# Altium schematic sheet Схема МК и датчиков Velvet Controller.SchDoc
size A2; SheetNumber: 2; SheetTotal: 6
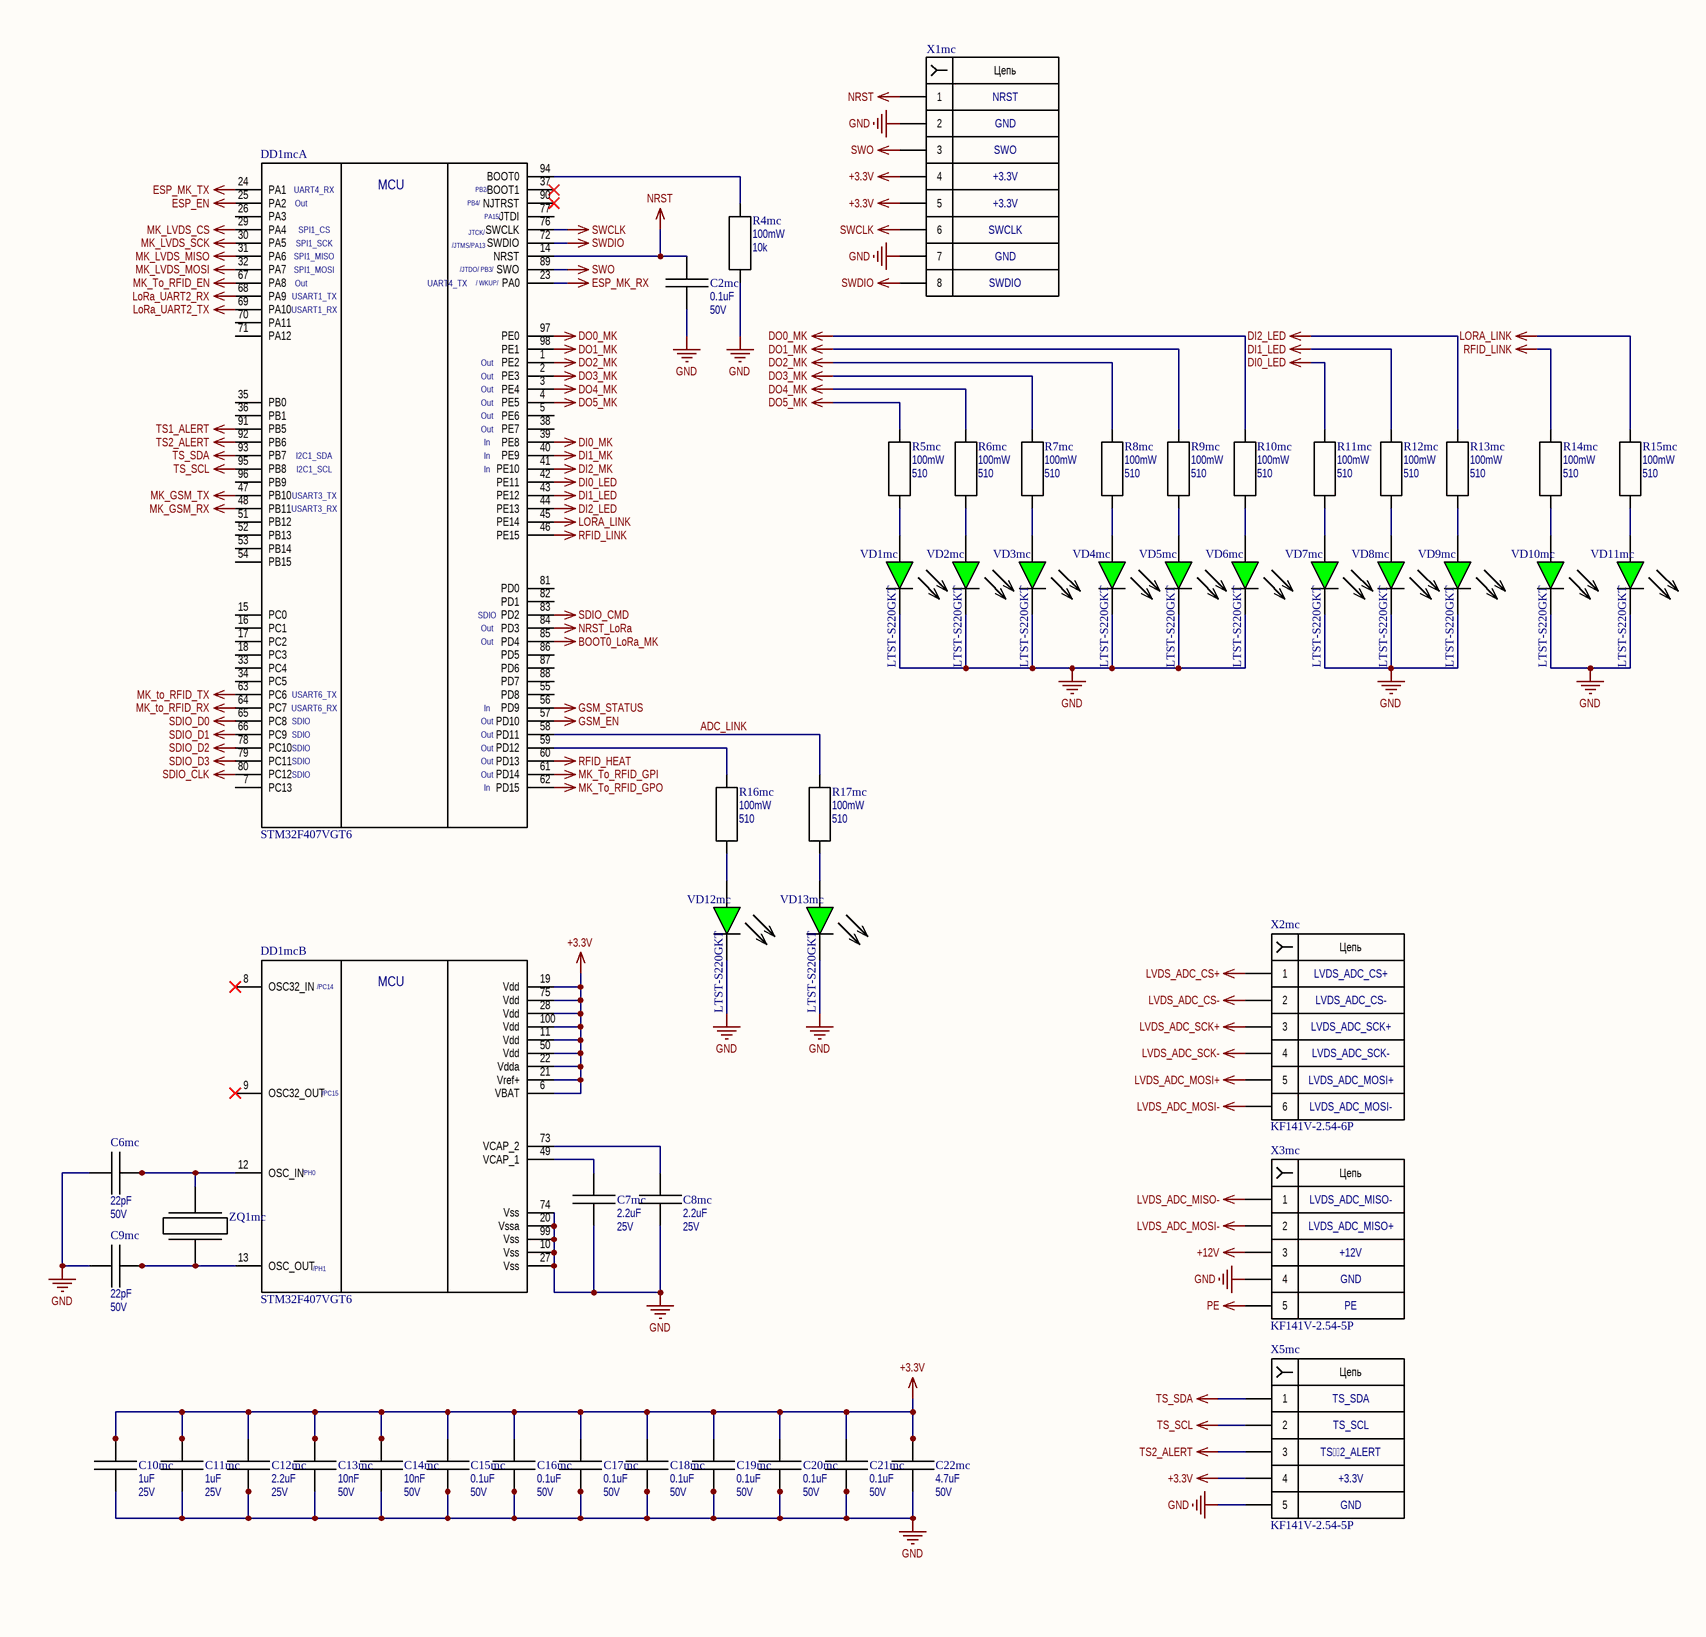
[diagram p0: Схема МК и датчиков Velvet Controller.SchDoc, left]
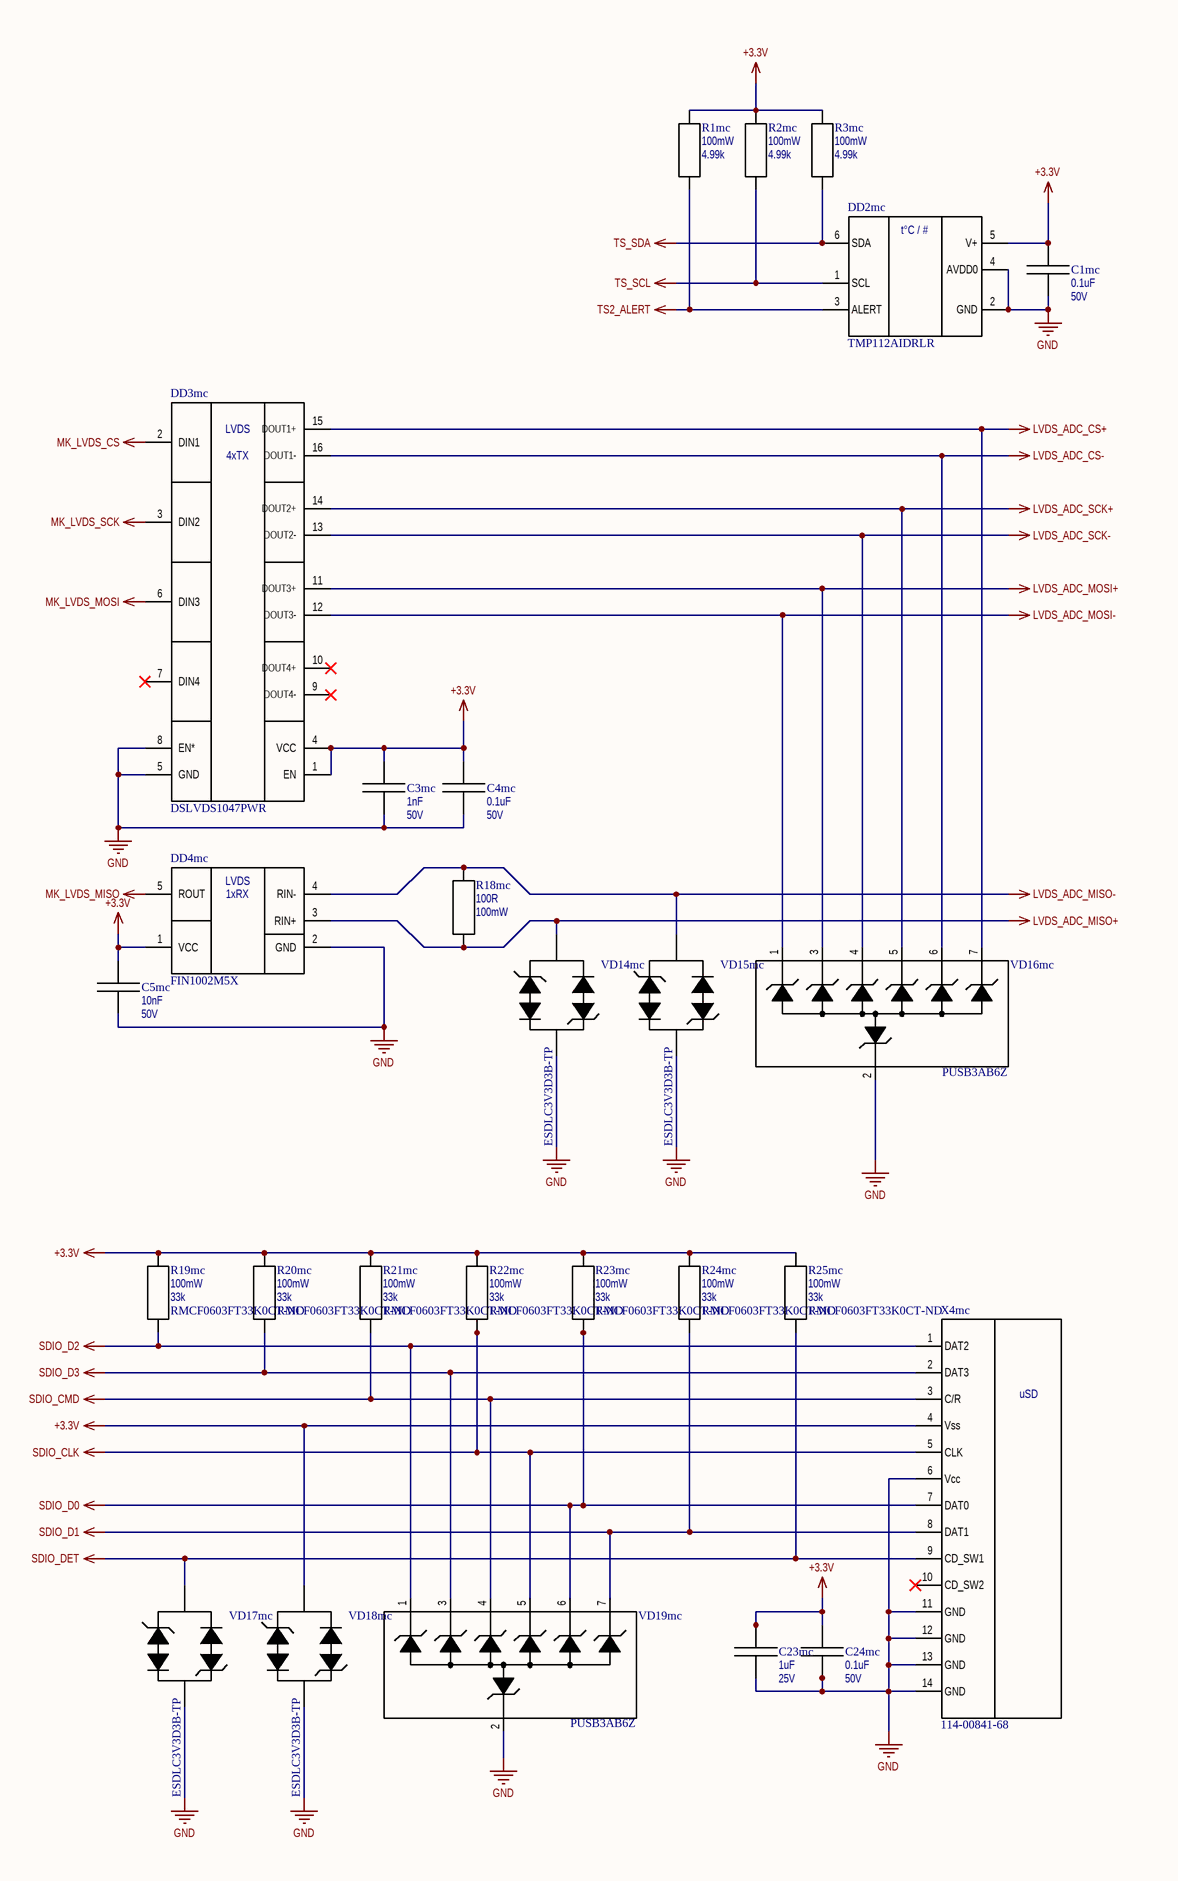
[diagram p1: Схема МК и датчиков Velvet Controller.SchDoc, right]

## Parts
C1mc  Capacitance: 0.1uF  Rated Voltage: 50V  [CAP 0603 IPC MAX]  (hidden comment: GCM188R71H104KA57D)
C2mc  Capacitance: 0.1uF  Rated Voltage: 50V  [CAP 0603 IPC MAX]  (hidden comment: GCM188R71H104KA57D)
C3mc  Capacitance: 1nF  Rated Voltage: 50V  [CAP 0603 IPC MAX]  (hidden comment: GCM188R71H102KA37D)
C4mc  Capacitance: 0.1uF  Rated Voltage: 50V  [CAP 0603 IPC MAX]  (hidden comment: GCM188R71H104KA57D)
C5mc  Capacitance: 10nF  Rated Voltage: 50V  [CAP 0603 IPC MAX]  (hidden comment: CL10B103KB8NNNC)
C6mc  Capacitance: 22pF  Rated Voltage: 50V  [CAP 0603 IPC MAX]  (hidden comment: CC0603JRNPO9BN220)
C7mc  Capacitance: 2.2uF  Rated Voltage: 25V  [CAP 0603 IPC MAX]  (hidden comment: GRM188R61E225KA12D)
C8mc  Capacitance: 2.2uF  Rated Voltage: 25V  [CAP 0603 IPC MAX]  (hidden comment: GRM188R61E225KA12D)
C9mc  Capacitance: 22pF  Rated Voltage: 50V  [CAP 0603 IPC MAX]  (hidden comment: CC0603JRNPO9BN220)
C10mc  Capacitance: 1uF  Rated Voltage: 25V  [CAP 0603 IPC MAX]  (hidden comment: TMK107BJ105KA-T)
C11mc  Capacitance: 1uF  Rated Voltage: 25V  [CAP 0603 IPC MAX]  (hidden comment: TMK107BJ105KA-T)
C12mc  Capacitance: 2.2uF  Rated Voltage: 25V  [CAP 0603 IPC MAX]  (hidden comment: GRM188R61E225KA12D)
C13mc  Capacitance: 10nF  Rated Voltage: 50V  [CAP 0603 IPC MAX]  (hidden comment: CL10B103KB8NNNC)
C14mc  Capacitance: 10nF  Rated Voltage: 50V  [CAP 0603 IPC MAX]  (hidden comment: CL10B103KB8NNNC)
C15mc  Capacitance: 0.1uF  Rated Voltage: 50V  [CAP 0603 IPC MAX]  (hidden comment: GCM188R71H104KA57D)
C16mc  Capacitance: 0.1uF  Rated Voltage: 50V  [CAP 0603 IPC MAX]  (hidden comment: GCM188R71H104KA57D)
C17mc  Capacitance: 0.1uF  Rated Voltage: 50V  [CAP 0603 IPC MAX]  (hidden comment: GCM188R71H104KA57D)
C18mc  Capacitance: 0.1uF  Rated Voltage: 50V  [CAP 0603 IPC MAX]  (hidden comment: GCM188R71H104KA57D)
C19mc  Capacitance: 0.1uF  Rated Voltage: 50V  [CAP 0603 IPC MAX]  (hidden comment: GCM188R71H104KA57D)
C20mc  Capacitance: 0.1uF  Rated Voltage: 50V  [CAP 0603 IPC MAX]  (hidden comment: GCM188R71H104KA57D)
C21mc  Capacitance: 0.1uF  Rated Voltage: 50V  [CAP 0603 IPC MAX]  (hidden comment: GCM188R71H104KA57D)
C22mc  Capacitance: 4.7uF  Rated Voltage: 50V  [CAP 0805 IPC MAX]  (hidden comment: CL21A475KBQNNNE)
C23mc  Capacitance: 1uF  Rated Voltage: 25V  [CAP 0603 IPC MAX]  (hidden comment: TMK107BJ105KA-T)
C24mc  Capacitance: 0.1uF  Rated Voltage: 50V  [CAP 0603 IPC MAX]  (hidden comment: GCM188R71H104KA57D)
DD1mc  STM32F407VGT6  [LQFP50P1600X1600X160-100M]  (parts A,B of 2)
DD2mc  TMP112AIDRLR  [SOT-563]
DD3mc  DSLVDS1047PWR  [TSSOP-16]
DD4mc  FIN1002M5X  [SOT-23-5]
R1mc  Rated Power: 100mW  Resistance: 4.99k  [RES 0603 IPC MAX]  (hidden comment: RC0603FR-074K99L)
R2mc  Rated Power: 100mW  Resistance: 4.99k  [RES 0603 IPC MAX]  (hidden comment: RC0603FR-074K99L)
R3mc  Rated Power: 100mW  Resistance: 4.99k  [RES 0603 IPC MAX]  (hidden comment: RC0603FR-074K99L)
R4mc  Power Rated: 100mW  Resistance: 10k  [RES 0603 IPC MAX]  (hidden comment: RMCF0603JT10K0)
R5mc  Power Rated: 100mW  Resistance: 510  [RES 0603 IPC MAX]  (hidden comment: RMCF0603JT510R)
R6mc  Power Rated: 100mW  Resistance: 510  [RES 0603 IPC MAX]  (hidden comment: RMCF0603JT510R)
R7mc  Power Rated: 100mW  Resistance: 510  [RES 0603 IPC MAX]  (hidden comment: RMCF0603JT510R)
R8mc  Power Rated: 100mW  Resistance: 510  [RES 0603 IPC MAX]  (hidden comment: RMCF0603JT510R)
R9mc  Power Rated: 100mW  Resistance: 510  [RES 0603 IPC MAX]  (hidden comment: RMCF0603JT510R)
R10mc  Power Rated: 100mW  Resistance: 510  [RES 0603 IPC MAX]  (hidden comment: RMCF0603JT510R)
R11mc  Power Rated: 100mW  Resistance: 510  [RES 0603 IPC MAX]  (hidden comment: RMCF0603JT510R)
R12mc  Power Rated: 100mW  Resistance: 510  [RES 0603 IPC MAX]  (hidden comment: RMCF0603JT510R)
R13mc  Power Rated: 100mW  Resistance: 510  [RES 0603 IPC MAX]  (hidden comment: RMCF0603JT510R)
R14mc  Power Rated: 100mW  Resistance: 510  [RES 0603 IPC MAX]  (hidden comment: RMCF0603JT510R)
R15mc  Power Rated: 100mW  Resistance: 510  [RES 0603 IPC MAX]  (hidden comment: RMCF0603JT510R)
R16mc  Power Rated: 100mW  Resistance: 510  [RES 0603 IPC MAX]  (hidden comment: RMCF0603JT510R)
R17mc  Power Rated: 100mW  Resistance: 510  [RES 0603 IPC MAX]  (hidden comment: RMCF0603JT510R)
R18mc  Resistance: 100R  Rated Power: 100mW  [RES 0603 IPC MAX]  (hidden comment: RMCF0603FT100R)
R19mc  Power Rated: 100mW  Resistance: 33k  Supplier Part Number 1: RMCF0603FT33K0CT-ND  [RES 0603 IPC MAX]  (hidden comment: RMCF0603FT33K0)
R20mc  Power Rated: 100mW  Resistance: 33k  Supplier Part Number 1: RMCF0603FT33K0CT-ND  [RES 0603 IPC MAX]  (hidden comment: RMCF0603FT33K0)
R21mc  Power Rated: 100mW  Resistance: 33k  Supplier Part Number 1: RMCF0603FT33K0CT-ND  [RES 0603 IPC MAX]  (hidden comment: RMCF0603FT33K0)
R22mc  Power Rated: 100mW  Resistance: 33k  Supplier Part Number 1: RMCF0603FT33K0CT-ND  [RES 0603 IPC MAX]  (hidden comment: RMCF0603FT33K0)
R23mc  Power Rated: 100mW  Resistance: 33k  Supplier Part Number 1: RMCF0603FT33K0CT-ND  [RES 0603 IPC MAX]  (hidden comment: RMCF0603FT33K0)
R24mc  Power Rated: 100mW  Resistance: 33k  Supplier Part Number 1: RMCF0603FT33K0CT-ND  [RES 0603 IPC MAX]  (hidden comment: RMCF0603FT33K0)
R25mc  Power Rated: 100mW  Resistance: 33k  Supplier Part Number 1: RMCF0603FT33K0CT-ND  [RES 0603 IPC MAX]  (hidden comment: RMCF0603FT33K0)
VD1mc  LTST-S220GKT  [0805 DIODE]
VD2mc  LTST-S220GKT  [0805 DIODE]
VD3mc  LTST-S220GKT  [0805 DIODE]
VD4mc  LTST-S220GKT  [0805 DIODE]
VD5mc  LTST-S220GKT  [0805 DIODE]
VD6mc  LTST-S220GKT  [0805 DIODE]
VD7mc  LTST-S220GKT  [0805 DIODE]
VD8mc  LTST-S220GKT  [0805 DIODE]
VD9mc  LTST-S220GKT  [0805 DIODE]
VD10mc  LTST-S220GKT  [0805 DIODE]
VD11mc  LTST-S220GKT  [0805 DIODE]
VD12mc  LTST-S220GKT  [0805 DIODE]
VD13mc  LTST-S220GKT  [0805 DIODE]
VD14mc  ESDLC3V3D3B-TP  [SOD-323 (UNMARKED)]
VD15mc  ESDLC3V3D3B-TP  [SOD-323 (UNMARKED)]
VD16mc  PUSB3AB6Z  [DFN2111-7 (SOT1358-1)]
VD17mc  ESDLC3V3D3B-TP  [SOD-323 (UNMARKED)]
VD18mc  ESDLC3V3D3B-TP  [SOD-323 (UNMARKED)]
VD19mc  PUSB3AB6Z  [DFN2111-7 (SOT1358-1)]
X1mc  TSW-104-07-F-D  [HEADER 2.54mm 2ROW 8PIN]  (value not drawn)
X2mc  KF141V-2.54-6P  [KF141V-2.54-6P]
X3mc  KF141V-2.54-5P  [KF141V-2.54-5P]
X4mc  114-00841-68  [114-00841-68]
X5mc  KF141V-2.54-5P  [KF141V-2.54-5P]
ZQ1mc  ABM3-8.000MHZ-D2Y-T  [ABM3-8.000MHZ-D2Y-T]  (value not drawn)

## Nets
+3.3V: C1mc.1 C3mc.1 C4mc.1 C5mc.1 C10mc.1 C11mc.1 C12mc.1 C13mc.1 C14mc.1 C15mc.1 C16mc.1 C17mc.1 C18mc.1 C19mc.1 C20mc.1 C21mc.1 C22mc.1 C23mc.2 C24mc.1 DD1mc.6(VBAT) DD1mc.11(Vdd) DD1mc.19(Vdd) DD1mc.21(Vref+) DD1mc.22(Vdda) DD1mc.28(Vdd) DD1mc.50(Vdd) DD1mc.75(Vdd) DD1mc.100(Vdd) DD2mc.5(V+) DD3mc.1(EN) DD3mc.4(VCC) DD4mc.1(VCC) R1mc.2 R2mc.2 R3mc.2 R19mc.2 R20mc.1 R21mc.1 R22mc.1 R23mc.1 R24mc.1 R25mc.1 VD18mc.2 X1mc.4 X1mc.5 X4mc.4(Vss) X5mc.4
+12V: X3mc.3
BOOT0_LoRa_MK: DD1mc.85(PD4)
DI0_LED: DD1mc.42(PE11) R11mc.2
DI0_MK: DD1mc.39(PE8)
DI1_LED: DD1mc.43(PE12) R12mc.2
DI1_MK: DD1mc.40(PE9)
DI2_LED: DD1mc.44(PE13) R13mc.2
DI2_MK: DD1mc.41(PE10)
DO0_MK: DD1mc.97(PE0) R10mc.2
DO1_MK: DD1mc.98(PE1) R9mc.2
DO2_MK: DD1mc.1(PE2) R8mc.2
DO3_MK: DD1mc.2(PE3) R7mc.2
DO4_MK: DD1mc.3(PE4) R6mc.2
DO5_MK: DD1mc.4(PE5) R5mc.2
ESP_EN: DD1mc.25(PA2)
ESP_MK_RX: DD1mc.23(PA0)
ESP_MK_TX: DD1mc.24(PA1)
GND: C1mc.2 C2mc.2 C3mc.2 C4mc.2 C5mc.2 C6mc.1 C7mc.2 C8mc.2 C9mc.1 C10mc.2 C11mc.2 C12mc.2 C13mc.2 C14mc.2 C15mc.2 C16mc.2 C17mc.2 C18mc.2 C19mc.2 C20mc.2 C21mc.2 C22mc.2 C23mc.1 C24mc.2 DD1mc.10(Vss) DD1mc.20(Vssa) DD1mc.27(Vss) DD1mc.74(Vss) DD1mc.99(Vss) DD2mc.2(GND) DD2mc.4(AVDD0) DD3mc.5(GND) DD3mc.8(EN*) DD4mc.2(GND) R4mc.1 VD1mc.2 VD2mc.2 VD3mc.2 VD4mc.2 VD5mc.2 VD6mc.2 VD7mc.2 VD8mc.2 VD9mc.2 VD10mc.2 VD11mc.2 VD12mc.2 VD13mc.2 VD14mc.1 VD15mc.1 VD16mc.2 VD17mc.1 VD18mc.1 VD19mc.2 X1mc.2 X1mc.7 X3mc.4 X4mc.6(Vcc) X4mc.11(GND) X4mc.12(GND) X4mc.13(GND) X4mc.14(GND) X5mc.5
GSM_EN: DD1mc.57(PD10)
GSM_STATUS: DD1mc.56(PD9)
LORA_LINK: DD1mc.45(PE14) R15mc.2
LoRa_UART2_RX: DD1mc.68(PA9)
LoRa_UART2_TX: DD1mc.69(PA10)
LVDS_ADC_CS+: DD3mc.15(DOUT1+) VD16mc.7 X2mc.1
LVDS_ADC_CS-: DD3mc.16(DOUT1-) VD16mc.6 X2mc.2
LVDS_ADC_MISO+: DD4mc.3(RIN+) R18mc.1 VD14mc.2
LVDS_ADC_MISO-: DD4mc.4(RIN-) R18mc.2 VD15mc.2 X3mc.1
LVDS_ADC_MOSI+: DD3mc.11(DOUT3+) VD16mc.3 X2mc.5
LVDS_ADC_MOSI-: DD3mc.12(DOUT3-) VD16mc.1 X2mc.6 X3mc.2
LVDS_ADC_SCK+: DD3mc.14(DOUT2+) VD16mc.5 X2mc.3
LVDS_ADC_SCK-: DD3mc.13(DOUT2-) VD16mc.4 X2mc.4
MK_GSM_RX: DD1mc.48(PB11)
MK_GSM_TX: DD1mc.47(PB10)
MK_LVDS_CS: DD1mc.29(PA4) DD3mc.2(DIN1)
MK_LVDS_MISO: DD1mc.31(PA6) DD4mc.5(ROUT)
MK_LVDS_MOSI: DD1mc.32(PA7) DD3mc.6(DIN3)
MK_LVDS_SCK: DD1mc.30(PA5) DD3mc.3(DIN2)
MK_To_RFID_EN: DD1mc.67(PA8)
MK_To_RFID_GPI: DD1mc.61(PD14)
MK_To_RFID_GPO: DD1mc.62(PD15)
MK_to_RFID_RX: DD1mc.64(PC7)
MK_to_RFID_TX: DD1mc.63(PC6)
NRST: C2mc.1 DD1mc.14(NRST) X1mc.1
NRST_LoRa: DD1mc.84(PD3)
PE: X3mc.5
RFID_HEAT: DD1mc.60(PD13)
RFID_LINK: DD1mc.46(PE15) R14mc.2
SDIO_CLK: DD1mc.80(PC12) R22mc.2 VD19mc.5 X4mc.5(CLK)
SDIO_CMD: DD1mc.83(PD2) R21mc.2 VD19mc.4 X4mc.3(C/R)
SDIO_D0: DD1mc.65(PC8) R23mc.2 VD19mc.6 X4mc.7(DAT0)
SDIO_D1: DD1mc.66(PC9) R24mc.2 VD19mc.7 X4mc.8(DAT1)
SDIO_D2: DD1mc.78(PC10) R19mc.1 VD19mc.1 X4mc.1(DAT2)
SDIO_D3: DD1mc.79(PC11) R20mc.2 VD19mc.3 X4mc.2(DAT3)
SDIO_DET: R25mc.2 VD17mc.2 X4mc.9(CD_SW1)
SWCLK: DD1mc.76(SWCLK) X1mc.6
SWDIO: DD1mc.72(SWDIO) X1mc.8
SWO: DD1mc.89(SWO) X1mc.3
TS1_ALERT: DD1mc.91(PB5)
TS2_ALERT: DD1mc.92(PB6) DD2mc.3(ALERT) R1mc.1 X5mc.3
TS_SCL: DD1mc.95(PB8) DD2mc.1(SCL) R2mc.1 X5mc.2
TS_SDA: DD1mc.93(PB7) DD2mc.6(SDA) R3mc.1 X5mc.1
ADC_LINK: DD1mc.58(PD11) R17mc.2
NetC6mc_2: C6mc.2 DD1mc.12(OSC_IN) ZQ1mc.2
NetC7mc_1: C7mc.1 DD1mc.49(VCAP_1)
NetC8mc_1: C8mc.1 DD1mc.73(VCAP_2)
NetC9mc_2: C9mc.2 DD1mc.13(OSC_OUT) ZQ1mc.1
NetDD1mc_59: DD1mc.59(PD12) R16mc.2
NetDD1mc_94: DD1mc.94(BOOT0) R4mc.2
NetR5mc_1: R5mc.1 VD1mc.1
NetR6mc_1: R6mc.1 VD2mc.1
NetR7mc_1: R7mc.1 VD3mc.1
NetR8mc_1: R8mc.1 VD4mc.1
NetR9mc_1: R9mc.1 VD5mc.1
NetR10mc_1: R10mc.1 VD6mc.1
NetR11mc_1: R11mc.1 VD7mc.1
NetR12mc_1: R12mc.1 VD8mc.1
NetR13mc_1: R13mc.1 VD9mc.1
NetR14mc_1: R14mc.1 VD10mc.1
NetR15mc_1: R15mc.1 VD11mc.1
NetR16mc_1: R16mc.1 VD12mc.1
NetR17mc_1: R17mc.1 VD13mc.1

Not connected (* = marked no-connect by the designer): DD1mc 5(PE6) 7(PC13) 8(OSC32_IN)* 9(OSC32_OUT)* 15(PC0) 16(PC1) 17(PC2) 18(PC3) 26(PA3) 33(PC4) 34(PC5) 35(PB0) 36(PB1) 37(BOOT1)* 38(PE7) 51(PB12) 52(PB13) 53(PB14) 54(PB15) 55(PD8) 70(PA11) 71(PA12) 77(JTDI) 81(PD0) 82(PD1) 86(PD5) 87(PD6) 88(PD7) 90(NJTRST)* 96(PB9); DD3mc 7(DIN4)* 9(DOUT4-)* 10(DOUT4+)*; X4mc 10(CD_SW2)*

## Notes on the sheet
- NRST
- SWO
- GND
- +3.3V
- (near DD1mc) Out
- (near DD1mc) UART4_RX
- (near DD1mc) SPI1_CS
- (near DD1mc) SPI1_SCK
- SWCLK
- (near DD1mc) USART1_TX
- (near DD1mc) USART1_RX
- (near DD1mc) SPI1_MOSI
- (near DD1mc) SPI1_MISO
- (near DD1mc) UART4_TX
- SWDIO
- (near DD1mc) In
- (near DD1mc) USART3_TX
- (near DD1mc) USART3_RX
- (near DD1mc) I2C1_SDA
- (near DD1mc) I2C1_SCL
- (near DD1mc) SDIO
- (near DD1mc) USART6_TX
- (near DD1mc) USART6_RX
- (near X2mc) LVDS_ADC_CS+
- (near X2mc) LVDS_ADC_CS-
- (near X2mc) LVDS_ADC_SCK+
- (near X2mc) LVDS_ADC_SCK-
- (near X2mc) LVDS_ADC_MOSI+
- (near X2mc) LVDS_ADC_MOSI-
- (near X3mc) LVDS_ADC_MISO-
- (near X3mc) LVDS_ADC_MISO+
- +12V
- PE
- TS_SCL
- TS_SDA
- (near X5mc) TS2_ALERT
- (in symbol 114-00841-68) uSD
- (in symbol DSLVDS1047PWR) LVDS; 4xTX
- (in symbol FIN1002M5X) LVDS; 1xRX
- (in symbol KF141V-2.54-5P) Цепь
- (in symbol KF141V-2.54-6P) Цепь
- (in symbol STM32F407VGT6, part A) MCU; PB2/; PB4/; PA15/; JTCK/; /JTMS/PA13; /JTDO/ PB3/; / WKUP/
- (in symbol STM32F407VGT6, part B) MCU; /PC14; /PC15; /PH0; /PH1
- (in symbol TMP112AIDRLR) t°C / #
- (in symbol TSW-104-07-F-D) Цепь

## Library data of the parts
C1mc C2mc C4mc C15mc C16mc C17mc C18mc C19mc C20mc C21mc C24mc = GCM188R71H104KA57D: CAP SMD CER 0.1UF 50V X7R 0603; Manufacturer 1: Murata Electronics; Tolerance: 10%; Type: Multilayer Ceramic; Manufacturer Part Number 1: GCM188R71H104KA57D; Min Operating Temperature: -55°C; Max Operating Temperature: 125°C; Mounting: SM; Package: 0603; Supplier 1: Digi-Key; Supplier Part Number 1: 490-4779-1-ND
C3mc = GCM188R71H102KA37D: CAP SMD CER 1000PF 50V X7R 0603; Manufacturer 1: Murata Electronics; Tolerance: 10%; Type: Multilayer Ceramic; Manufacturer Part Number 1: GCM188R71H102KA37D; Min Operating Temperature: -55°C; Max Operating Temperature: 125°C; Mounting: SM; Package: 0603; Supplier 1: Digi-Key; Supplier Part Number 1: 490-4777-1-ND
C5mc C13mc C14mc = CL10B103KB8NNNC: CAP SMD CER 10000PF 50V X7R 0603; Manufacturer 1: Samsung Electro-Mechanics; Tolerance: 10%; Type: Multilayer Ceramic; Manufacturer Part Number 1: CL10B103KB8NNNC; Min Operating Temperature: -55°C; Max Operating Temperature: 125°C; Mounting: SM; Package: 0603; Supplier 1: Digi-Key; Supplier Part Number 1: 1276-1009-1-ND
C6mc C9mc = CC0603JRNPO9BN220: CAP SMD CER 22PF 50V NP0  0603; Manufacturer 1: YAGEO; Tolerance: 5%; Type: Multilayer Ceramic; Manufacturer Part Number 1: CC0603JRNPO9BN220; Min Operating Temperature: -55°C; Max Operating Temperature: 125°C; Mounting: SM; Package: 0603; Supplier 1: Digi-Key; Supplier Part Number 1: 311-1062-1-ND
C7mc C8mc C12mc = GRM188R61E225KA12D: CAP SMD CER 2.2UF 25V X5R 0603; Manufacturer 1: Murata Electronics; Tolerance: 10%; Type: Multilayer Ceramic; Manufacturer Part Number 1: GRM188R61E225KA12D; Min Operating Temperature: -55°C; Max Operating Temperature: 85°C; Mounting: SM; Package: 0603; Supplier 1: Digi-Key; Supplier Part Number 1: 490-10731-1-ND
C10mc C11mc C23mc = TMK107BJ105KA-T: CAP SMD CER 1UF 25V X5R 0603; Manufacturer 1: Taiyo Yuden; Tolerance: 10%; Type: Multilayer Ceramic; Manufacturer Part Number 1: TMK107BJ105KA-T; Min Operating Temperature: -55°C; Max Operating Temperature: 85°C; Mounting: SM; Package: 0603; Supplier 1: Digi-Key; Supplier Part Number 1: 587-1248-1-ND
C22mc = CL21A475KBQNNNE: CAP SMD CER 4.7UF 50V X5R 0805; Manufacturer 1: Samsung Electro-Mechanics; Tolerance: 10%; Type: Multilayer Ceramic; Manufacturer Part Number 1: CL21A475KBQNNNE; Min Operating Temperature: -55°C; Max Operating Temperature: 85°C; Mounting: SM; Package: 0805; Supplier 1: Digi-Key; Supplier Part Number 1: 1276-1248-1-ND
DD1mc = STM32F407VGT6: IC MCU 32BIT 1MB FLASH 100LQFP; Manufacturer 1: STMicroelectronics; Core Size: 32-Bit Single-Core; Speed: 168MHz; Number of I/O: 82; Program Memory Size: 1MB (1M x 8); RAM Size: 192K x 8; Voltage - Supply (Vcc/Vdd): 1.8V ~ 3.6V; Number Of DAC: 2x12b; Number Of ADC: 16x12b; Core Processor: ARM® Cortex®-M4; Manufacturer Part Number 1: STM32F407VGT6; Program Memory Type: FLASH; Mounting Type: SM; Min Operating Temperature: -40°C; Max Operating Temperature: 85°C; Package / Case: 100-LQFP (14x14)
DD2mc = TMP112AIDRLR: SOT-563 TEMPERATURE SENSORS ROHS; Manufacturer 1: UMW; Max Accuracy: ±0.1°C; Min Accuracy: ±1°C; Resolution: 12b; Interface: I²C/SMBus; Manufacturer Part Number 1: TMP112AIDRLR; Max Operating Temperature: 150°C; Min Operating Temperature: -55°C; Mounting Type: SM; Package: SOT-563; Supplier 1: Digi-Key; Supplier Part Number 1: 296-38578-1-ND
DD3mc = DSLVDS1047PWR: IC DRIVER LVDS FULL 4/0 16TSSOP; Manufacturer 1: Texas Instruments; Number Of Receivers: 0; Number Of Drivers: 4; Data Rate: 400Mbps; Voltage Supply Range: 3...3.6V; Manufacturer Part Number 1: DSLVDS1047PWR; Min Operating Temperature: -40°C; Max Operating Temperature: 85°C; Package: 16-TSSOP; Mounting: SM; Supplier 1: Digi-Key; Supplier Part Number 1: 296-50740-1-ND
DD4mc = FIN1002M5X: IC RECEIVER LVDS 0/1 SOT23-5; Manufacturer 1: onsemi; Number Of Receivers: 1; Number Of Drivers: 0; Data Rate: 400Mbps; Voltage Supply Range: 3...3.6V; Manufacturer Part Number 1: FIN1002M5X; Min Operating Temperature: -40°C; Max Operating Temperature: 125°C; Package: SOT-23-5; Mounting: SM; Supplier 1: Digi-Key; Supplier Part Number 1: FIN1002M5XCT-ND
R1mc R2mc R3mc = RC0603FR-074K99L: RES SMD 4.99K OHM 1% 1/10W 0603; Manufacturer 1: YAGEO; Rated Voltage: 75V; Manufacturer Part Number 1: RC0603FR-074K99L; Tolerance: 1%; Package: 0603; Min Operating Temperature: -55°C; Max Operating Temperature: 155°C; Qualification: -
R4mc = RMCF0603JT10K0: RES SMD 10K OHM 5% 1/10W 0603; Manufacturer 1: Stackpole Electronics Inc; Voltage Rated: 75V; Manufacturer Part Number 1: RMCF0603JT10K0; Min Operating Temperature: -55°C; Max Operating Temperature: 155°C; Tolerance: 5%; Package: 0603; Ratings: AEC-Q200; Supplier 1: Digi-Key; Supplier Part Number 1: RMCF0603JT10K0CT-ND
R5mc R6mc R7mc R8mc R9mc R10mc R11mc R12mc R13mc R14mc R15mc R16mc R17mc = RMCF0603JT510R: RES SMD 510 OHM 5% 1/10W 0603; Manufacturer 1: Stackpole Electronics Inc; Voltage Rated: 75V; Manufacturer Part Number 1: RMCF0603JT510R; Min Operating Temperature: -55°C; Max Operating Temperature: 155°C; Tolerance: 5%; Package: 0603; Ratings: AEC-Q200; Supplier 1: Digi-Key; Supplier Part Number 1: RMCF0603JT510RCT-ND
R18mc = RMCF0603FT100R: RES SMD 100 OHM 1% 1/10W 0603; Manufacturer 1: Stackpole Electronics Inc; Rated Voltage: 75V; Qualification: AEC-Q200; Manufacturer Part Number 1: RMCF0603FT100R; Tolerance: 1%; Package: 0603; Min Operating Temperature: -55°C; Max Operating Temperature: 155°C; Supplier 1: Digi-Key; Supplier Part Number 1: RMCF0603FT100RCT-ND
R19mc R20mc R21mc R22mc R23mc R24mc R25mc = RMCF0603FT33K0: RES SMD 33K OHM 1% 1/10W 0603; Manufacturer 1: Stackpole Electronics Inc; Voltage Rated: 75V; Manufacturer Part Number 1: RMCF0603FT33K0; Min Operating Temperature: -55°C; Max Operating Temperature: 155°C; Tolerance: 1%; Package: 0603; Ratings: AEC-Q200; Supplier 1: Digi-Key
VD1mc VD2mc VD3mc VD4mc VD5mc VD6mc VD7mc VD8mc VD9mc VD10mc VD11mc VD12mc VD13mc = LTST-S220GKT: LED GREEN CLEAR SMD R/A; Manufacturer 1: Lite-On Inc.; Max Continious Current: 30mA; Max Pulse Current: 120mA; Reverse Voltage: 5V; Power Dissipation: 100mW; Forward Voltage: 2.2V; Manufacturer Part Number 1: LTST-S220GKT; Max Operating Temperature: +85°C; Package: 0805
VD14mc VD15mc VD17mc VD18mc = ESDLC3V3D3B-TP: TVS DIODE 3.3VWM 36VC SOD323; Manufacturer 1: Micro Commercial Co; Voltage - Reverse Standoff (Typ): 3.3V; Voltage - Breakdown (Min): 4V; Voltage - Clamping (Max) @ Ipp: 36V; Current - Peak Pulse (10/1000µs): 28A (8/20µs); Type: Biderectional; Number Of Chanels: 6; Max Pulse Power: 350W; Manufacturer Part Number 1: ESDLC3V3D3B-TP; Mounting: SM; Max Operating Temperature: 150°C; Min Operating Temperature: -55°C; Package: SOD-323
VD16mc VD19mc = PUSB3AB6Z: TVS DIODE 3.3VWM 6VC 7XSON; Manufacturer 1: Nexperia USA Inc.; Voltage - Reverse Standoff (Typ): 3.3V (Max); Voltage - Breakdown (Min): 6V; Voltage - Clamping (Max) @ Ipp: 6V (Typ); Current - Peak Pulse (10/1000µs): 5A (8/20µs); Type: Biderectional; Number Of Chanels: 6; Manufacturer Part Number 1: PUSB3AB6Z; Mounting: SM; Max Operating Temperature: 85°C; Min Operating Temperature: -40°C; Package: 7-XFDFN
X1mc = TSW-104-07-F-D: CONN HEADER VERT 8POS 2.54MM 2ROWx4; Manufacturer 1: Samtec Inc.; Rated Voltage: 400V; Rated Current: 2A; Contact Length - Mating: 5.84mm; Overall Contact Length: 10.92mm; Min Operating Temperatire: -55℃; Max Operating Temperature: 125℃; Contact Length - Post: 2.54mm; Insulation Height: 2.54mm; Manufacturer Part Number 1: TSW-104-07-F-D; Pitch: 2.54mm; Supplier 1: Digi-Key; Supplier Part Number 1: SAM8996-ND
X2mc = KF141V-2.54-6P: TERMINAL BLOCK 6 PIN 2.54mm 2A 150V T/H; pin to pad: 1>1+7 2>2+8 3>3+9 4>4+10 5>5+11 6>6+12; Manufacturer 1: CIXI KEFA ELECTRONICS CO.,LTD.; Rated Current: 10A; Suitable Wire: 20...26AWG; Pitch: 2.54mm x 5.08mm; Rated Voltage: 150V; Min Operating Temperatire: -40℃; Max Operating Temperature: 105℃; Pins: 6+6; Manufacturer Part Number 1: KF141V-2.54-6P; Max Length: 17.78mm; Max Width: 12.7mm; Max Height: 13.8mm
X3mc X5mc = KF141V-2.54-5P: TERMINAL BLOCK 5 PIN 2.54mm 2A 150V T/H; pin to pad: 1>1+6 2>2+7 3>3+8 4>4+9 5>5+10; Manufacturer 1: CIXI KEFA ELECTRONICS CO.,LTD.; Rated Current: 10A; Suitable Wire: 20...26AWG; Pitch: 2.54mm x 5.08mm; Rated Voltage: 150V; Min Operating Temperatire: -40℃; Max Operating Temperature: 105℃; Pins: 5+5; Manufacturer Part Number 1: KF141V-2.54-5P; Max Length: 15.24mm; Max Width: 12.7mm; Max Height: 13.8mm
X4mc = 114-00841-68: CONN MICRO SD CARD PUSH-PULL R/A; Manufacturer 1: Amphenol ICC (Commercial Products); Card Type: Secure Digital - microSD™; Number of Positions: 10 (8 + 2); Connector Type: Connector; Insertion, Removal Method: Push In, Pull Out; Manufacturer Part Number 1: 114-00841-68; Features: Switch; Mounting: SM; Contact Finish: Gold; Contact Finish Thickness: 0.38µm; Supplier 1: Digi-Key; Supplier Part Number 1: 114-00841-68-1-ND
ZQ1mc = ABM3-8.000MHZ-D2Y-T: CRYSTAL 8.0000MHZ 18PF SMD; Manufacturer 1: Abracon LLC; Frequency: 8MHz; Frequency Stability: ±30ppm; ESR (Equivalent Series Resistance): 140 Ohms; Manufacturer Part Number 1: ABM3-8.000MHZ-D2Y-T; Mounting Type: SM; Package: 2-SMD, No Lead; Load Capacitance: 18pF; Max Operating Temperature: 85°C; Min Operating Temperature: -40°C